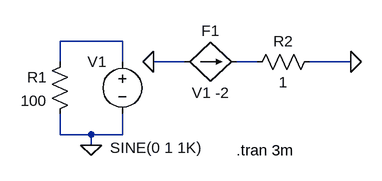
[diagram p0: schematic Fig_2-81_F-Source.asc]
Fig_2-81_F-Source.asc, the LTspice schematic file:
Version 4
SHEET 1 880 680
WIRE 272 112 176 112
WIRE 176 144 176 112
WIRE 272 144 272 112
WIRE 368 144 320 144
WIRE 480 144 448 144
WIRE 624 144 560 144
WIRE 176 256 176 224
WIRE 224 256 176 256
WIRE 272 256 272 224
WIRE 272 256 224 256
WIRE 224 272 224 256
FLAG 624 144 0
FLAG 320 144 0
FLAG 224 272 0
SYMBOL f 368 144 R270
WINDOW 0 32 40 VTop 2
WINDOW 3 -32 40 VBottom 2
SYMATTR InstName F1
SYMATTR Value V1 -2
SYMBOL voltage 272 128 M0
WINDOW 3 -123 148 Left 2
WINDOW 123 0 0 Left 2
WINDOW 39 0 0 Left 2
SYMATTR Value SINE(0 1 1K)
SYMATTR InstName V1
SYMBOL res 192 128 M0
SYMATTR InstName R1
SYMATTR Value 100
SYMBOL res 464 160 R270
WINDOW 0 32 56 VTop 2
WINDOW 3 0 56 VBottom 2
SYMATTR InstName R2
SYMATTR Value 1
TEXT 448 280 Left 2 !.tran 3m

The netlist it stands for:
* Fig_2-81_F-Source.asc
F1 0 N002 V1 -2
V1 N001 0 SINE(0 1 1K)
R1 N001 0 100
R2 N002 0 1
.tran 3m
.backanno
.end